# Altium schematic sheet sptCtlSch.SCHDOC: LiveDesign Evaluation - Video Games
size B; Organization: Altium Limited; Address1: L3, 12a Rodborough Rd; Address2: Frenchs Forest; Address3: NSW; Address4: Australia 2086; DocumentNumber: 5; SheetNumber: 5; SheetTotal: 13
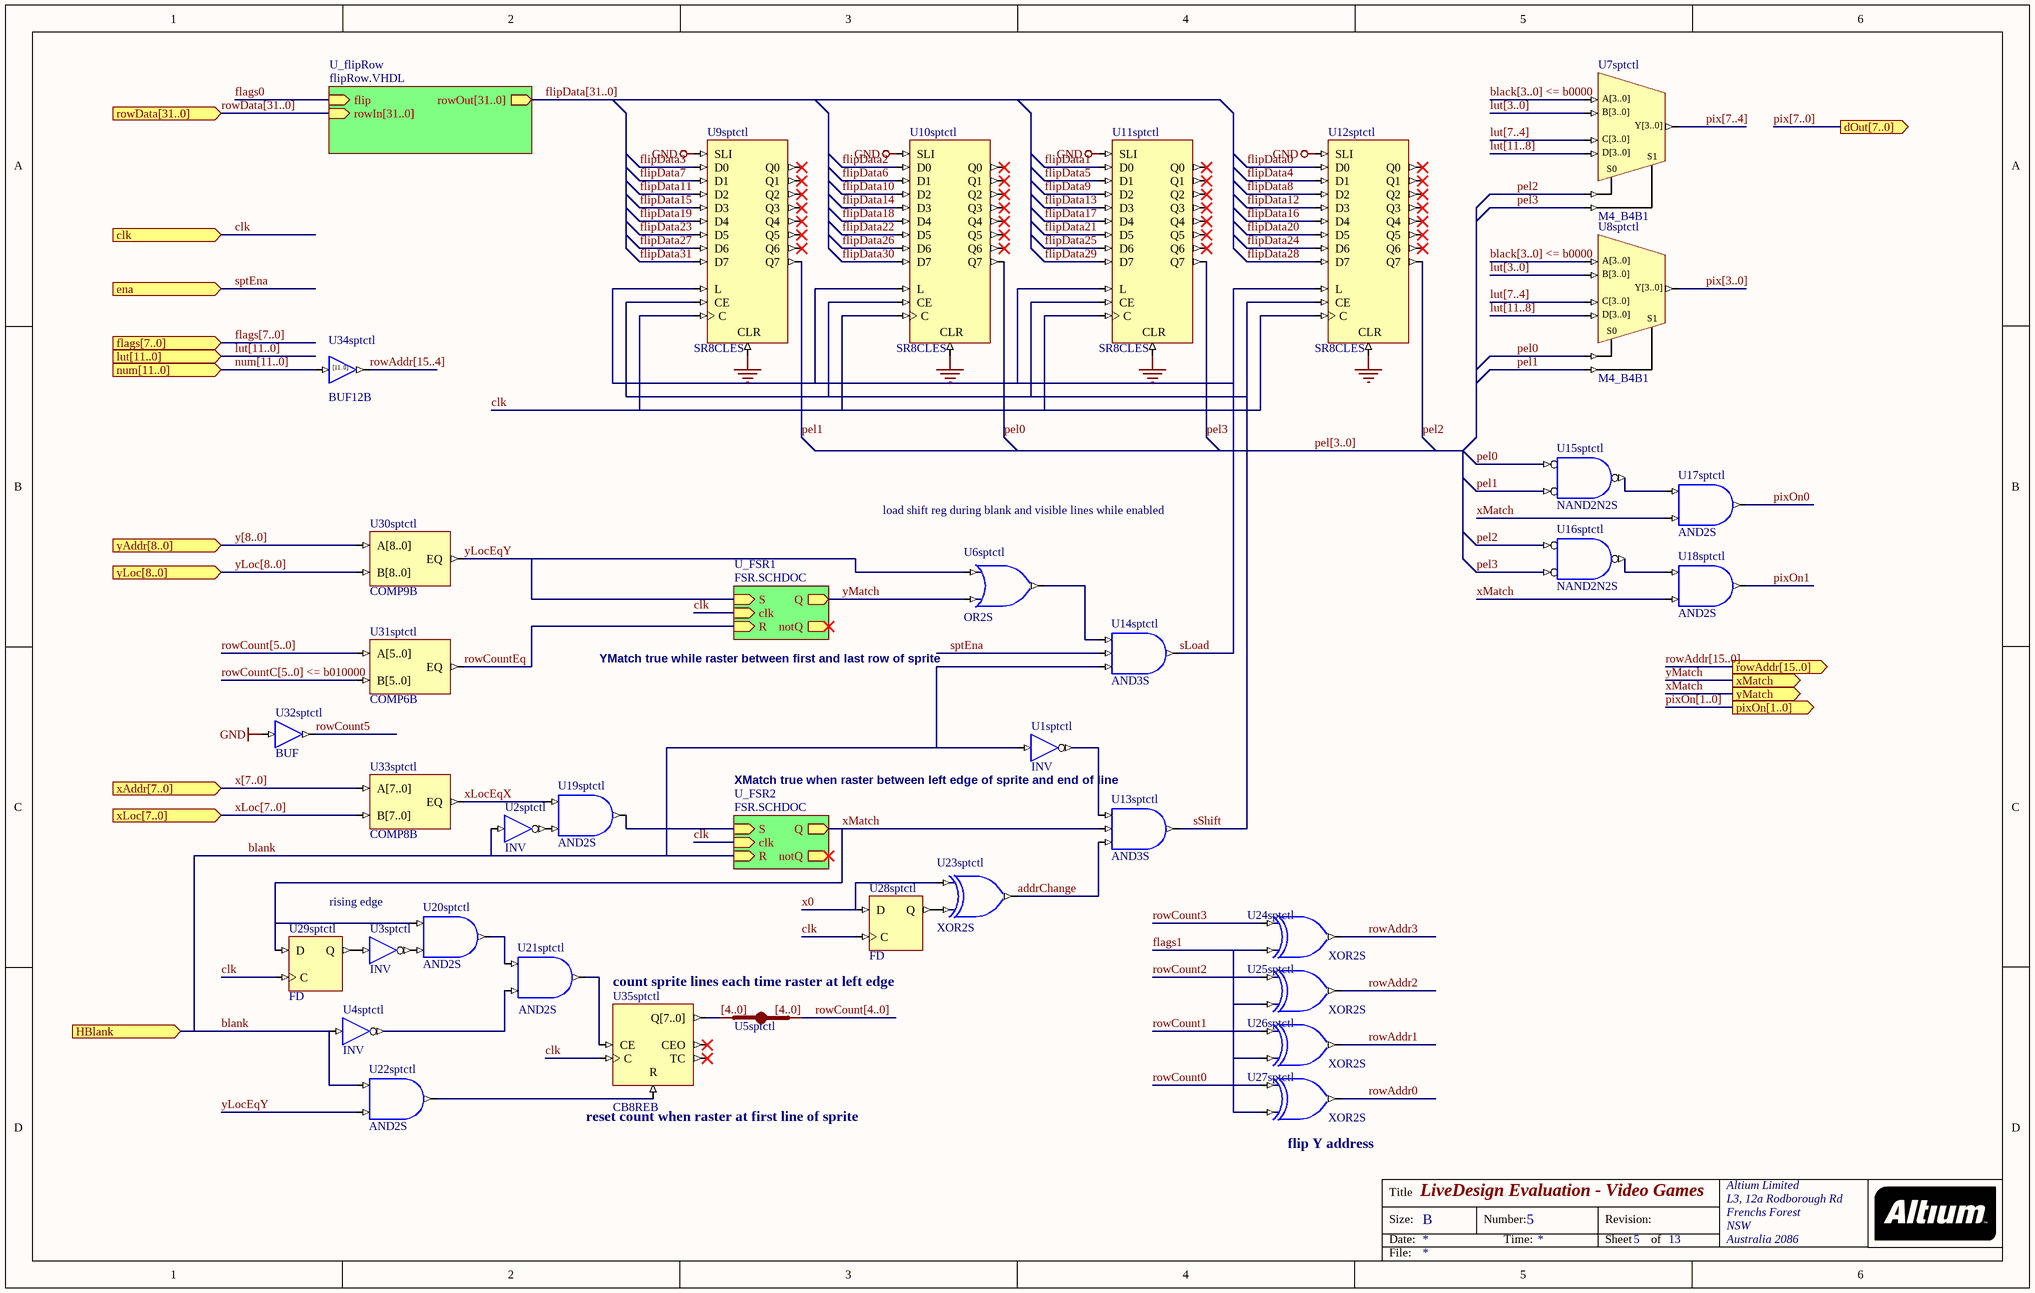
[diagram p0: sptCtlSch.SCHDOC]

## Parts
U1sptctl  INV
U2sptctl  INV
U3sptctl  INV
U4sptctl  INV
U5sptctl  IndexA: [4..0]  (hidden comment: JB)
U6sptctl  OR2S
U7sptctl  M4_B4B1
U8sptctl  M4_B4B1
U9sptctl  SR8CLES
U10sptctl  SR8CLES
U11sptctl  SR8CLES
U12sptctl  SR8CLES
U13sptctl  AND3S
U14sptctl  AND3S
U15sptctl  NAND2N2S
U16sptctl  NAND2N2S
U17sptctl  AND2S
U18sptctl  AND2S
U19sptctl  AND2S
U20sptctl  AND2S
U21sptctl  AND2S
U22sptctl  AND2S
U23sptctl  XOR2S
U24sptctl  XOR2S
U25sptctl  XOR2S
U26sptctl  XOR2S
U27sptctl  XOR2S
U28sptctl  FD
U29sptctl  FD
U30sptctl  COMP9B
U31sptctl  COMP6B
U32sptctl  BUF
U33sptctl  COMP8B
U34sptctl  BUF12B
U35sptctl  CB8REB

## Sub-sheets
U_flipRow = flipRow.VHDL: flip (in), rowIn[31..0] (in), rowOut[31..0] (out)  | VHDLENTITY: flipRow
U_FSR1 = FSR.SCHDOC: clk (in), Q (out), R (in), S (in), notQ (out)
U_FSR2 = FSR.SCHDOC: clk (in), Q (out), R (in), S (in), notQ (out)

## Ports
clk (in), dOut[7..0] (out), ena (in), flags[7..0] (in), HBlank (in), lut[11..0] (in), num[11..0] (in), pixOn[1..0] (out), rowAddr[15..0] (out), rowData[31..0] (in), xAddr[7..0] (in), xLoc[7..0] (in), xMatch (out), yAddr[8..0] (in), yLoc[8..0] (in), yMatch (out)

## Nets
GND: U9sptctl.CLR U9sptctl.SLI U10sptctl.CLR U10sptctl.SLI U11sptctl.CLR U11sptctl.SLI U12sptctl.CLR U12sptctl.SLI U32sptctl.I
addrChange: U13sptctl.I2 U23sptctl.O
black[3..0] <= b0000: U7sptctl.A[3..0] U8sptctl.A[3..0]
blank: U1sptctl.I U2sptctl.I U4sptctl.I U14sptctl.I2 U22sptctl.I0 ; port HBlank, sheet U_FSR2/R
clk: U9sptctl.C U10sptctl.C U11sptctl.C U12sptctl.C U28sptctl.C U29sptctl.C U35sptctl.C ; port clk, sheet U_FSR2/clk, sheet U_FSR1/clk
flags0: sheet U_flipRow/flip
flags1: U24sptctl.I1 U25sptctl.I1 U26sptctl.I1 U27sptctl.I1
flipData0: U12sptctl.D0
flipData1: U11sptctl.D0
flipData2: U10sptctl.D0
flipData3: U9sptctl.D0
flipData4: U12sptctl.D1
flipData5: U11sptctl.D1
flipData6: U10sptctl.D1
flipData7: U9sptctl.D1
flipData8: U12sptctl.D2
flipData9: U11sptctl.D2
flipData10: U10sptctl.D2
flipData11: U9sptctl.D2
flipData12: U12sptctl.D3
flipData13: U11sptctl.D3
flipData14: U10sptctl.D3
flipData15: U9sptctl.D3
flipData16: U12sptctl.D4
flipData17: U11sptctl.D4
flipData18: U10sptctl.D4
flipData19: U9sptctl.D4
flipData20: U12sptctl.D5
flipData21: U11sptctl.D5
flipData22: U10sptctl.D5
flipData23: U9sptctl.D5
flipData24: U12sptctl.D6
flipData25: U11sptctl.D6
flipData26: U10sptctl.D6
flipData27: U9sptctl.D6
flipData28: U12sptctl.D7
flipData29: U11sptctl.D7
flipData30: U10sptctl.D7
flipData31: U9sptctl.D7
lut[3..0]: U7sptctl.B[3..0] U8sptctl.B[3..0]
lut[7..4]: U7sptctl.C[3..0] U8sptctl.C[3..0]
lut[11..8]: U7sptctl.D[3..0] U8sptctl.D[3..0]
num[11..0]: U34sptctl.I[11..0] ; port num[11..0]
pel0: U8sptctl.S0 U10sptctl.Q7 U15sptctl.I0
pel1: U8sptctl.S1 U9sptctl.Q7 U15sptctl.I1
pel2: U7sptctl.S0 U12sptctl.Q7 U16sptctl.I0
pel3: U7sptctl.S1 U11sptctl.Q7 U16sptctl.I1
pix[3..0]: U8sptctl.Y[3..0]
pix[7..4]: U7sptctl.Y[3..0]
pixOn0: U17sptctl.O
pixOn1: U18sptctl.O
rowAddr0: U27sptctl.O
rowAddr1: U26sptctl.O
rowAddr2: U25sptctl.O
rowAddr3: U24sptctl.O
rowAddr[15..4]: U34sptctl.O[11..0]
rowCount0: U27sptctl.I0
rowCount1: U26sptctl.I0
rowCount2: U25sptctl.I0
rowCount3: U24sptctl.I0
rowCount5: U32sptctl.O
rowCount[4..0]: U5sptctl.B[0..0]
rowCount[5..0]: U31sptctl.A[5..0]
rowCountC[5..0] <= b010000: U31sptctl.B[5..0]
rowCountEq: U31sptctl.EQ ; sheet U_FSR1/R
sLoad: U9sptctl.L U10sptctl.L U11sptctl.L U12sptctl.L U14sptctl.O
sptEna: U14sptctl.I1 ; port ena
sShift: U9sptctl.CE U10sptctl.CE U11sptctl.CE U12sptctl.CE U13sptctl.O
x0: U23sptctl.I0 U28sptctl.D
x[7..0]: U33sptctl.A[7..0] ; port xAddr[7..0]
xLoc[7..0]: U33sptctl.B[7..0] ; port xLoc[7..0]
xLocEqX: U19sptctl.I0 U33sptctl.EQ
xMatch: U13sptctl.I1 U17sptctl.I1 U18sptctl.I1 U20sptctl.I0 U29sptctl.D ; port yMatch, sheet U_FSR2/Q
y[8..0]: U30sptctl.A[8..0] ; port yAddr[8..0]
yLoc[8..0]: U30sptctl.B[8..0] ; port yLoc[8..0]
yLocEqY: U6sptctl.I0 U22sptctl.I1 U30sptctl.EQ ; sheet U_FSR1/S
yMatch: U6sptctl.I1 ; port xMatch, sheet U_FSR1/Q
NetU1sptctl_O: U1sptctl.O U13sptctl.I0
NetU2sptctl_O: U2sptctl.O U19sptctl.I1
NetU3sptctl_I: U3sptctl.I U29sptctl.Q
NetU3sptctl_O: U3sptctl.O U20sptctl.I1
NetU4sptctl_O: U4sptctl.O U21sptctl.I1
NetU5sptctl_A[0..0]: U5sptctl.A[0..0] U35sptctl.Q[7..0]
NetU6sptctl_O: U6sptctl.O U14sptctl.I0
NetU15sptctl_O: U15sptctl.O U17sptctl.I0
NetU16sptctl_O: U16sptctl.O U18sptctl.I0
NetU19sptctl_O: U19sptctl.O ; sheet U_FSR2/S
NetU20sptctl_O: U20sptctl.O U21sptctl.I0
NetU21sptctl_O: U21sptctl.O U35sptctl.CE
NetU22sptctl_O: U22sptctl.O U35sptctl.R
NetU23sptctl_I1: U23sptctl.I1 U28sptctl.Q

Not connected (* = marked no-connect by the designer): U9sptctl Q0* Q1* Q2* Q3* Q4* Q5* Q6*; U10sptctl Q0* Q1* Q2* Q3* Q4* Q5* Q6*; U11sptctl Q0* Q1* Q2* Q3* Q4* Q5* Q6*; U12sptctl Q0* Q1* Q2* Q3* Q4* Q5* Q6*; U35sptctl CEO* TC*

## Buses and harness runs
bus black[3..0] <= b0000
bus flags[7..0] = port flags[7..0]
bus flipData[31..0] = sheet U_flipRow/rowOut[31..0]
bus lut[3..0]
bus lut[7..4]
bus lut[11..0] = port lut[11..0]
bus lut[11..8]
bus num[11..0] = port num[11..0]
bus pel[3..0]
bus pix[3..0]
bus pix[7..0] = port dOut[7..0]
bus pix[7..4]
bus pixOn[1..0] = port pixOn[1..0]
bus rowAddr[15..0] = port rowAddr[15..0]
bus rowAddr[15..4]
bus rowCount[4..0]
bus rowCount[5..0]
bus rowCountC[5..0] <= b010000
bus rowData[31..0] = port rowData[31..0] = sheet U_flipRow/rowIn[31..0]
bus x[7..0] = port xAddr[7..0]
bus xLoc[7..0] = port xLoc[7..0]
bus y[8..0] = port yAddr[8..0]
bus yLoc[8..0] = port yLoc[8..0]

## Notes on the sheet
- load shift reg during blank and visible lines while enabled
- YMatch true while raster between first and last row of sprite
- XMatch true when raster between left edge of sprite and end of line
- rising edge
- count sprite lines each time raster at left edge
- (near U35sptctl) reset count when raster at first line of sprite
- (near U27sptctl) flip Y address
- Title
- Size:
- Date:
- B
- Number:
- Time:
- Revision:
- Sheet
- of
- File:
- (in symbol BUF12B) [11..0]

## Library data of the parts
U1sptctl U2sptctl U3sptctl U4sptctl = INV: Inverter; ArchiveName: GENERIC; Published: 9-30-2003; Publisher: Altium Limited; Xilinx Equivalent: INV; Core Revision: 1.00.00
U5sptctl = JB: System BUS Joiner; ArchiveName: GENERIC; Published: 18-Dec-2003; Publisher: Altium Limited; Core Revision: 1.00.00; IndexB: [4..0]
U6sptctl = OR2S: 2-Input OR Gate, Single Pin Version; Xilinx Equivalent: OR2; ArchiveName: GENERIC; Published: 9-30-2003; Publisher: Altium Limited; Core Revision: 1.00.00
U7sptctl U8sptctl = M4_B4B1: 4x4-Bit Bus to 1x4-Bit Bus Multiplexer; ArchiveName: GENERIC; Published: 9-30-2003; Publisher: Altium Limited; Core Revision: 1.00.00
U9sptctl U10sptctl U11sptctl U12sptctl = SR8CLES: 8-Bit Loadable Serial/Parallel-In Parallel-Out Shift Registers with Clock Enable and Asynchronous Clear, Single Pin Version; ArchiveName: GENERIC; Published: 9-30-2003; Publisher: Altium Limited; Core Revision: 1.00.00
U13sptctl U14sptctl = AND3S: 3-Input AND Gate, Single Pin Version; Xilinx Equivalent: AND3; ArchiveName: GENERIC; Published: 9-30-2003; Publisher: Altium Limited; Core Revision: 1.00.00
U15sptctl U16sptctl = NAND2N2S: 2-Input NAND Gate with Active Low A and B Inputs, Single Pin Version; Xilinx Equivalent: NAND2B2; ArchiveName: GENERIC; Published: 9-30-2003; Publisher: Altium Limited; Core Revision: 1.00.00
U17sptctl U18sptctl U19sptctl U20sptctl U21sptctl U22sptctl = AND2S: 2-Input AND Gate, Single Pin Version; Xilinx Equivalent: AND2; ArchiveName: GENERIC; Publisher: Altium Limited; Core Revision: 1.00.00
  U17sptctl U18sptctl U19sptctl U20sptctl U21sptctl: Published: 9-30-2003
  U22sptctl: Published: 7-Nov-2003
U23sptctl U24sptctl U25sptctl U26sptctl U27sptctl = XOR2S: 2-Input Exclusive-OR Gate, Single Pin Version; Xilinx Equivalent: XOR2; ArchiveName: GENERIC; Published: 9-30-2003; Publisher: Altium Limited; Core Revision: 1.00.00
U28sptctl U29sptctl = FD: D-Type Flip-Flop; ArchiveName: GENERIC; Published: 9-30-2003; Publisher: Altium Limited; Xilinx Equivalent: FD; Core Revision: 1.00.00
U30sptctl = COMP9B: 9-Bit Identity Comparator, Bus Version; ArchiveName: GENERIC; Published: 7-Nov-2003; Publisher: Altium Limited; Core Revision: 1.00.00
U31sptctl = COMP6B: 6-Bit Identity Comparator, Bus Version; ArchiveName: GENERIC; Published: 9-30-2003; Publisher: Altium Limited; Core Revision: 1.00.00
U32sptctl = BUF: 1-bit General Purpose (Non-inverting) Buffer; ArchiveName: GENERIC; Published: 9-30-2003; Publisher: Altium Limited; Xilinx Equivalent: BUF; Core Revision: 1.00.00
U33sptctl = COMP8B: 8-Bit Identity Comparator, Bus Version; Xilinx Equivalent: COMP8; ArchiveName: GENERIC; Published: 9-30-2003; Publisher: Altium Limited; Core Revision: 1.00.00
U34sptctl = BUF12B: 12-Bit General Purpose (Non-inverting) Buffer, Bus Version; ArchiveName: GENERIC; Published: 7-Nov-2003; Publisher: Altium Limited; Core Revision: 1.00.00
U35sptctl = CB8REB: 8-Bit Cascadable Binary Counter with Clock Enable and Synchronous Reset, Bus Version; Xilinx Equivalent: CB8RE; ArchiveName: GENERIC; Published: 9-30-2003; Publisher: Altium Limited; Core Revision: 1.00.00